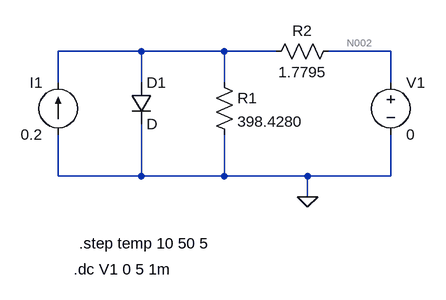
[diagram p0: schematic pv.asc]
pv.asc, the LTspice schematic file:
Version 4
SHEET 1 880 680
WIRE 96 96 -32 96
WIRE 224 96 96 96
WIRE 304 96 224 96
WIRE 480 96 384 96
WIRE -32 144 -32 96
WIRE 96 144 96 96
WIRE 224 144 224 96
WIRE 480 144 480 96
WIRE -32 288 -32 224
WIRE 96 288 96 208
WIRE 96 288 -32 288
WIRE 224 288 224 224
WIRE 224 288 96 288
WIRE 352 288 224 288
WIRE 480 288 480 224
WIRE 480 288 352 288
WIRE 352 320 352 288
FLAG 352 320 0
SYMBOL res 208 128 R0
SYMATTR InstName R1
SYMATTR Value 398.4280
SYMBOL res 288 112 R270
WINDOW 0 32 56 VTop 2
WINDOW 3 0 56 VBottom 2
SYMATTR InstName R2
SYMATTR Value 1.7795
SYMBOL diode 80 144 R0
SYMATTR InstName D1
SYMBOL voltage 480 128 R0
WINDOW 123 0 0 Left 0
WINDOW 39 24 124 Left 2
SYMATTR InstName V1
SYMATTR Value 0
SYMBOL current -32 224 R180
WINDOW 0 24 80 Left 2
WINDOW 3 24 0 Left 2
WINDOW 123 0 0 Left 0
WINDOW 39 0 0 Left 0
SYMATTR InstName I1
SYMATTR Value 0.2
TEXT -8 432 Left 2 !.dc V1 0 5 1m
TEXT 0 392 Left 2 !.step temp 10 50 5

The netlist it stands for:
* pv.asc
R1 N001 0 398.4280
R2 N001 N002 1.7795
D1 N001 0 D
V1 N002 0 0
I1 0 N001 0.2
.model D D
.lib standard.dio
.dc V1 0 5 1m
.step temp 10 50 5
.backanno
.end

* Results of the author's LTspice run, read from the files saved beside the schematic
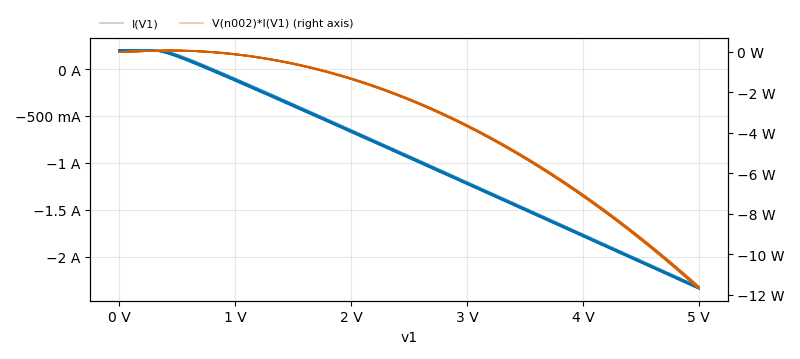
[diagram p1: DC transfer characteristic of pv.asc, plotted from the saved traces]
* DC transfer characteristic, 9 runs:
*   I(V1) [run 1]: 199.1 mA at v1=0 V, -2.317 A at v1=5 V, min -2.317 A, max 199.1 mA
*   I(V1) [run 2]: 199.1 mA at v1=0 V, -2.32 A at v1=5 V, min -2.32 A, max 199.1 mA
*   I(V1) [run 3]: 199.1 mA at v1=0 V, -2.323 A at v1=5 V, min -2.323 A, max 199.1 mA
*   I(V1) [run 4]: 199.1 mA at v1=0 V, -2.327 A at v1=5 V, min -2.327 A, max 199.1 mA
*   I(V1) [run 5]: 199.1 mA at v1=0 V, -2.33 A at v1=5 V, min -2.33 A, max 199.1 mA
*   I(V1) [run 6]: 199.1 mA at v1=0 V, -2.333 A at v1=5 V, min -2.333 A, max 199.1 mA
*   I(V1) [run 7]: 199.1 mA at v1=0 V, -2.336 A at v1=5 V, min -2.336 A, max 199.1 mA
*   I(V1) [run 8]: 199.1 mA at v1=0 V, -2.339 A at v1=5 V, min -2.339 A, max 199.1 mA
*   V(n002)*I(V1) [run 1]: 0 W at v1=0 V, -11.59 W at v1=5 V, min -11.59 W, max 78.89 mW
*   V(n002)*I(V1) [run 2]: 0 W at v1=0 V, -11.6 W at v1=5 V, min -11.6 W, max 77.63 mW
*   V(n002)*I(V1) [run 3]: 0 W at v1=0 V, -11.62 W at v1=5 V, min -11.62 W, max 76.38 mW
*   V(n002)*I(V1) [run 4]: 0 W at v1=0 V, -11.63 W at v1=5 V, min -11.63 W, max 75.13 mW
*   V(n002)*I(V1) [run 5]: 0 W at v1=0 V, -11.65 W at v1=5 V, min -11.65 W, max 73.89 mW
*   V(n002)*I(V1) [run 6]: 0 W at v1=0 V, -11.66 W at v1=5 V, min -11.66 W, max 72.65 mW
*   V(n002)*I(V1) [run 7]: 0 W at v1=0 V, -11.68 W at v1=5 V, min -11.68 W, max 71.42 mW
*   V(n002)*I(V1) [run 8]: 0 W at v1=0 V, -11.69 W at v1=5 V, min -11.69 W, max 70.2 mW